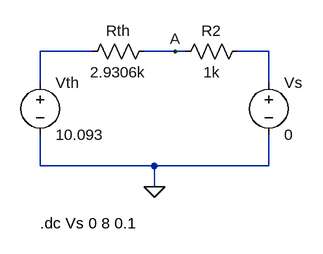
[diagram p0: schematic Circuit_7(1).asc]
Circuit_7(1).asc, the LTspice schematic file:
Version 4
SHEET 1 880 680
WIRE 144 80 64 80
WIRE 272 80 224 80
WIRE 288 80 272 80
WIRE 416 80 368 80
WIRE 64 128 64 80
WIRE 416 128 416 80
WIRE 64 256 64 208
WIRE 240 256 64 256
WIRE 416 256 416 208
WIRE 416 256 240 256
WIRE 240 288 240 256
FLAG 240 288 0
FLAG 272 80 A
SYMBOL voltage 64 112 R0
SYMATTR InstName Vth
SYMATTR Value 10.093
SYMBOL res 128 96 R270
WINDOW 0 32 56 VTop 2
WINDOW 3 0 56 VBottom 2
SYMATTR InstName Rth
SYMATTR Value 2.9306k
SYMBOL res 272 96 R270
WINDOW 0 32 56 VTop 2
WINDOW 3 0 56 VBottom 2
SYMATTR InstName R2
SYMATTR Value 1k
SYMBOL voltage 416 112 R0
SYMATTR InstName Vs
SYMATTR Value 0
TEXT 64 344 Left 2 !.dc Vs 0 8 0.1

The netlist it stands for:
* Circuit_7(1).asc
Vth N001 0 10.093
Rth N001 A 2.9306k
R2 A N002 1k
Vs N002 0 0
.dc Vs 0 8 0.1
.backanno
.end